# Altium schematic sheet Filters.SchDoc
size A2; SheetNumber: 2; SheetTotal: 3
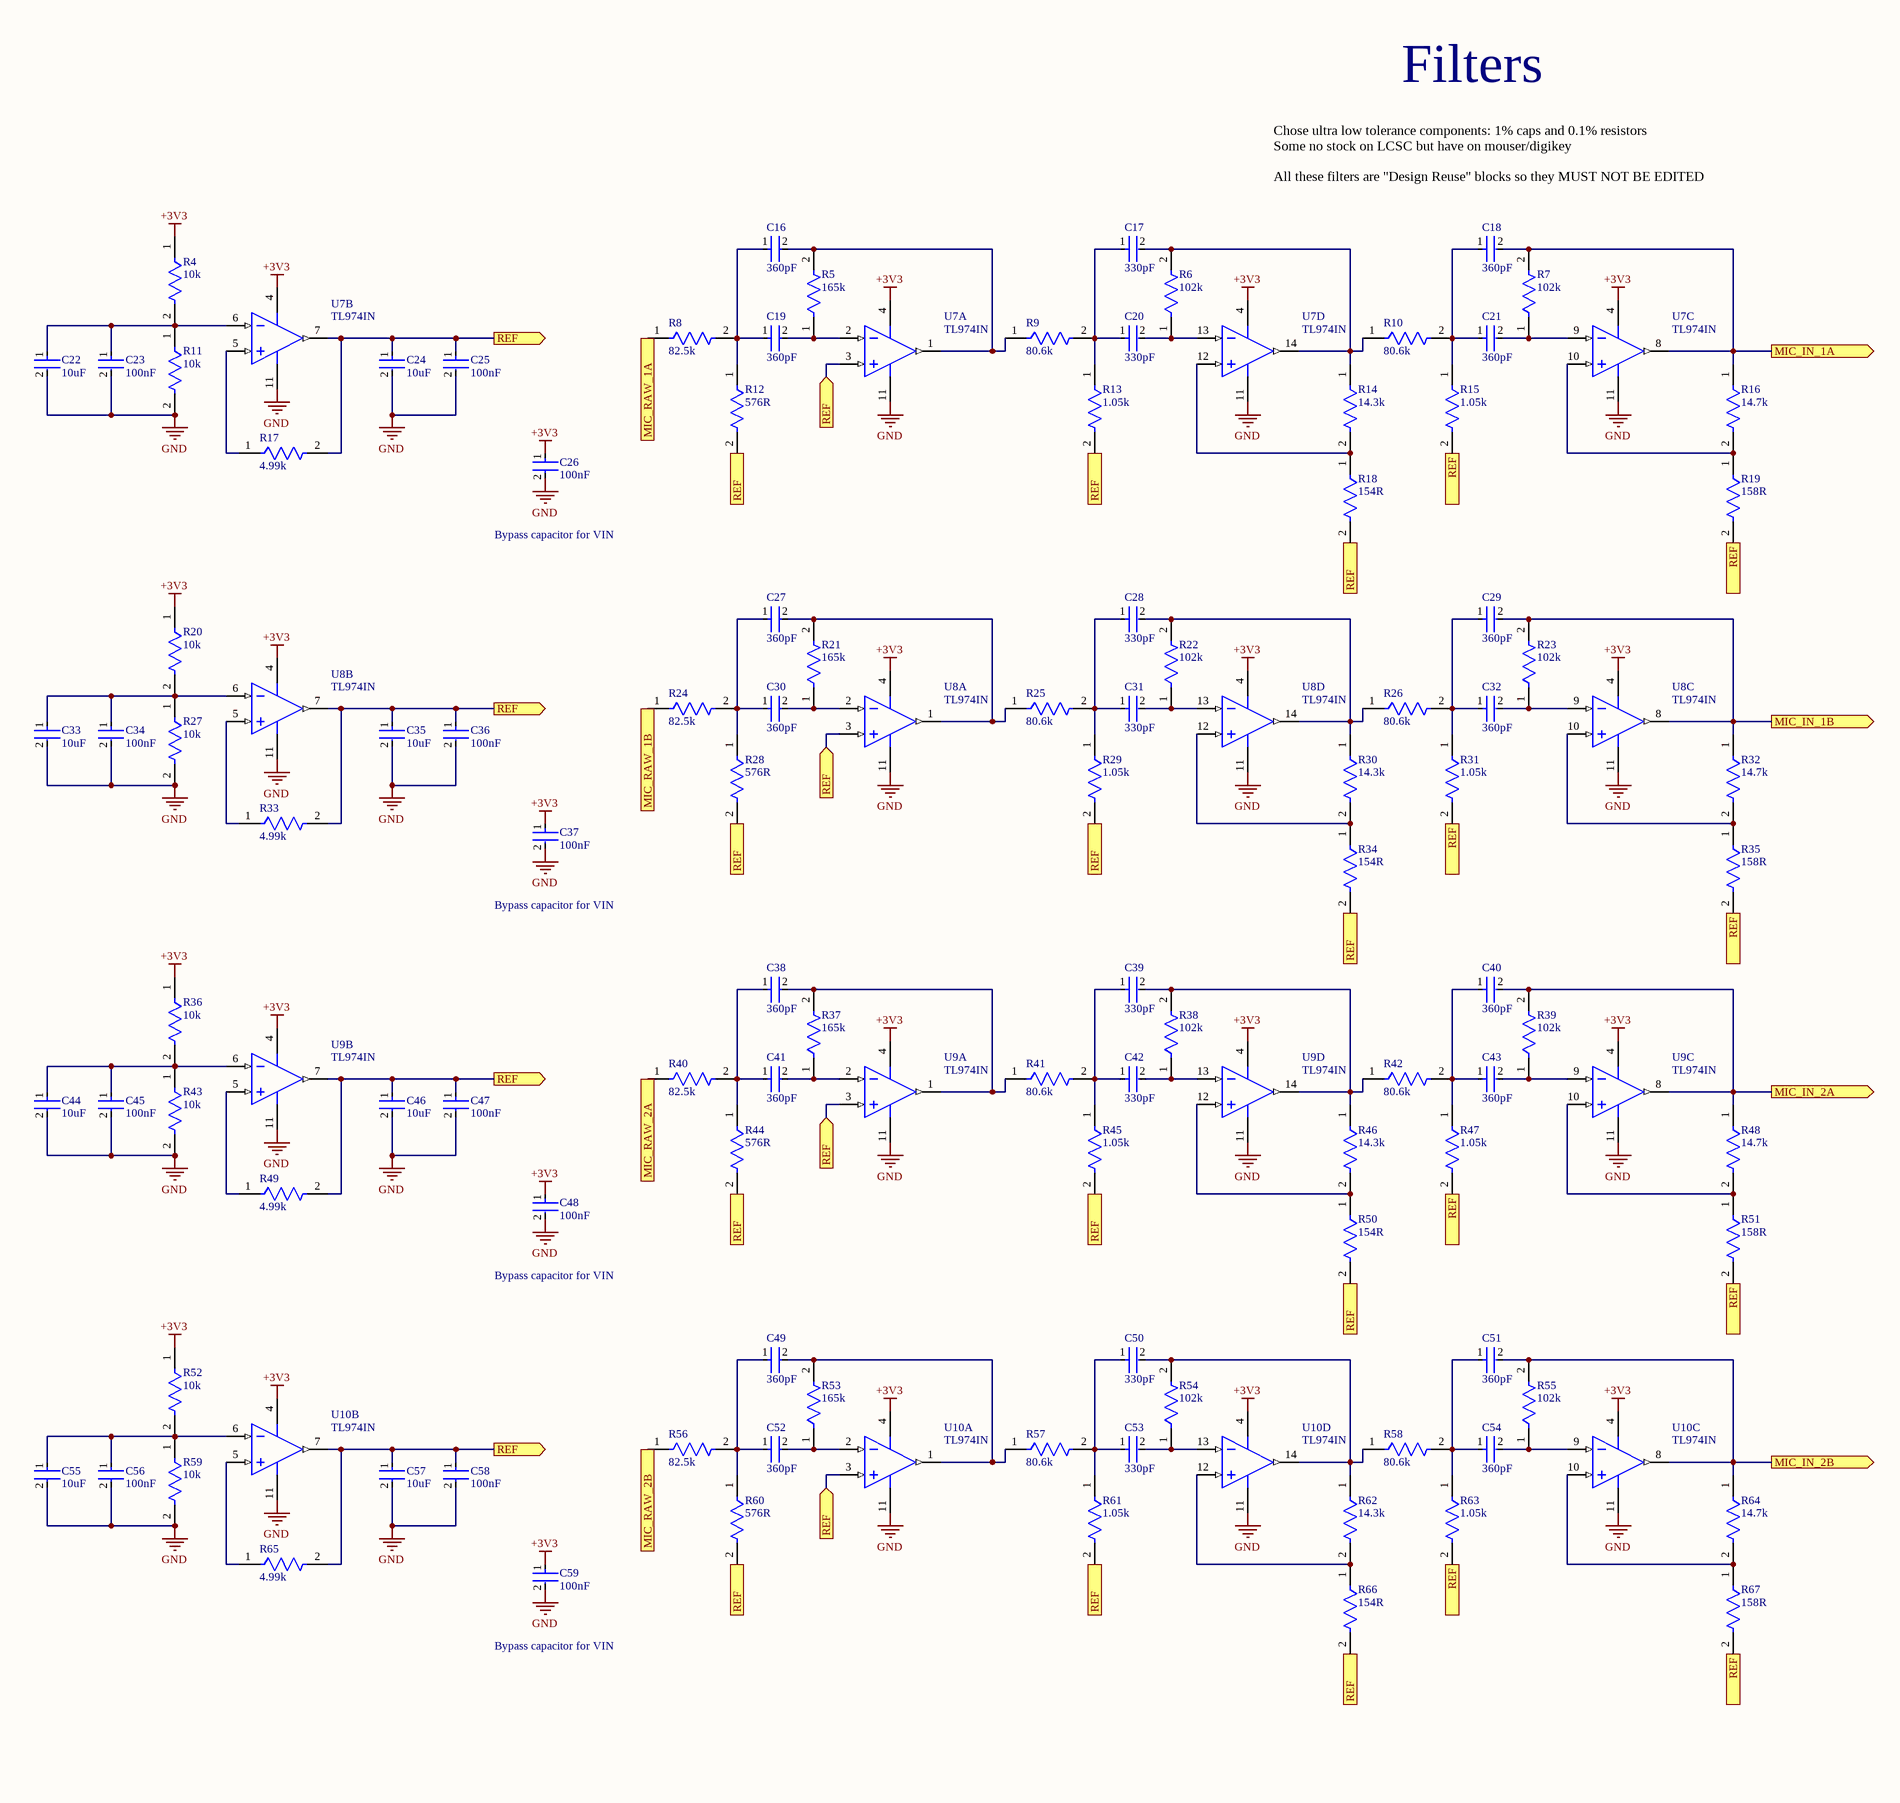
[diagram p0: Filters.SchDoc, left]
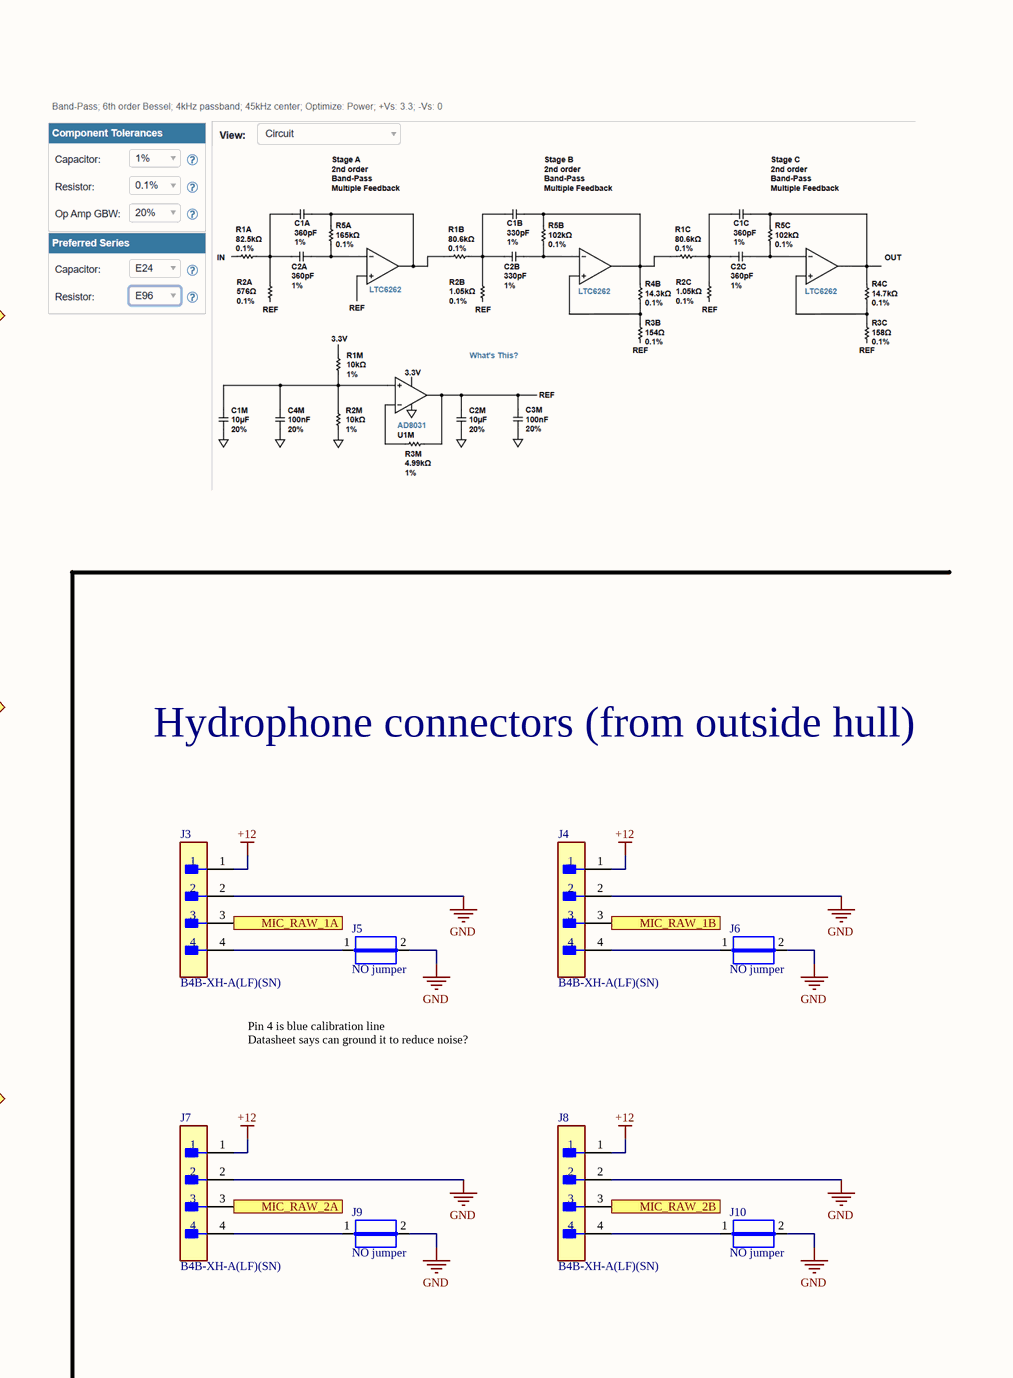
[diagram p1: Filters.SchDoc, right]

## Parts
C16  360pF  [FP-GCM188-0_1-IPC_A]
C17  330pF  [FP-GCM188-0_1-IPC_A]
C18  360pF  [FP-GCM188-0_1-IPC_A]
C19  360pF  [FP-GCM188-0_1-IPC_A]
C20  330pF  [FP-GCM188-0_1-IPC_A]
C21  360pF  [FP-GCM188-0_1-IPC_A]
C22  10uF  [FP-GCM188-0_1-IPC_A]
C23  100nF  [FP-GCM188-0_1-IPC_A]
C24  10uF  [FP-GCM188-0_1-IPC_A]
C25  100nF  [FP-GCM188-0_1-IPC_A]
C26  100nF  [FP-GCM188-0_1-IPC_A]
C27  360pF  [FP-GCM188-0_1-IPC_A]
C28  330pF  [FP-GCM188-0_1-IPC_A]
C29  360pF  [FP-GCM188-0_1-IPC_A]
C30  360pF  [FP-GCM188-0_1-IPC_A]
C31  330pF  [FP-GCM188-0_1-IPC_A]
C32  360pF  [FP-GCM188-0_1-IPC_A]
C33  10uF  [FP-GCM188-0_1-IPC_A]
C34  100nF  [FP-GCM188-0_1-IPC_A]
C35  10uF  [FP-GCM188-0_1-IPC_A]
C36  100nF  [FP-GCM188-0_1-IPC_A]
C37  100nF  [FP-GCM188-0_1-IPC_A]
C38  360pF  [FP-GCM188-0_1-IPC_A]
C39  330pF  [FP-GCM188-0_1-IPC_A]
C40  360pF  [FP-GCM188-0_1-IPC_A]
C41  360pF  [FP-GCM188-0_1-IPC_A]
C42  330pF  [FP-GCM188-0_1-IPC_A]
C43  360pF  [FP-GCM188-0_1-IPC_A]
C44  10uF  [FP-GCM188-0_1-IPC_A]
C45  100nF  [FP-GCM188-0_1-IPC_A]
C46  10uF  [FP-GCM188-0_1-IPC_A]
C47  100nF  [FP-GCM188-0_1-IPC_A]
C48  100nF  [FP-GCM188-0_1-IPC_A]
C49  360pF  [FP-GCM188-0_1-IPC_A]
C50  330pF  [FP-GCM188-0_1-IPC_A]
C51  360pF  [FP-GCM188-0_1-IPC_A]
C52  360pF  [FP-GCM188-0_1-IPC_A]
C53  330pF  [FP-GCM188-0_1-IPC_A]
C54  360pF  [FP-GCM188-0_1-IPC_A]
C55  10uF  [FP-GCM188-0_1-IPC_A]
C56  100nF  [FP-GCM188-0_1-IPC_A]
C57  10uF  [FP-GCM188-0_1-IPC_A]
C58  100nF  [FP-GCM188-0_1-IPC_A]
C59  100nF  [FP-GCM188-0_1-IPC_A]
J3  B4B-XH-A(LF)(SN)  [FP-B4B-XH-A_LF_SN-MFG]
J4  B4B-XH-A(LF)(SN)  [FP-B4B-XH-A_LF_SN-MFG]
J5  NO jumper  [JUMPER]
J6  NO jumper  [JUMPER]
J7  B4B-XH-A(LF)(SN)  [FP-B4B-XH-A_LF_SN-MFG]
J8  B4B-XH-A(LF)(SN)  [FP-B4B-XH-A_LF_SN-MFG]
J9  NO jumper  [JUMPER]
J10  NO jumper  [JUMPER]
R4  10k  [FP-RT0603-IPC_A]
R5  165k  [FP-RT0603-IPC_A]
R6  102k  [FP-RT0603-IPC_A]
R7  102k  [FP-RT0603-IPC_A]
R8  82.5k  [FP-RT0603-IPC_A]
R9  80.6k  [FP-RT0603-IPC_A]
R10  80.6k  [FP-RT0603-IPC_A]
R11  10k  [FP-RT0603-IPC_A]
R12  576R  [FP-RT0603-IPC_A]
R13  1.05k  [FP-RT0603-IPC_A]
R14  14.3k  [FP-RT0603-IPC_A]
R15  1.05k  [FP-RT0603-IPC_A]
R16  14.7k  [FP-RT0603-IPC_A]
R17  4.99k  [FP-RT0603-IPC_A]
R18  154R  [FP-RT0603-IPC_A]
R19  158R  [FP-RT0603-IPC_A]
R20  10k  [FP-RT0603-IPC_A]
R21  165k  [FP-RT0603-IPC_A]
R22  102k  [FP-RT0603-IPC_A]
R23  102k  [FP-RT0603-IPC_A]
R24  82.5k  [FP-RT0603-IPC_A]
R25  80.6k  [FP-RT0603-IPC_A]
R26  80.6k  [FP-RT0603-IPC_A]
R27  10k  [FP-RT0603-IPC_A]
R28  576R  [FP-RT0603-IPC_A]
R29  1.05k  [FP-RT0603-IPC_A]
R30  14.3k  [FP-RT0603-IPC_A]
R31  1.05k  [FP-RT0603-IPC_A]
R32  14.7k  [FP-RT0603-IPC_A]
R33  4.99k  [FP-RT0603-IPC_A]
R34  154R  [FP-RT0603-IPC_A]
R35  158R  [FP-RT0603-IPC_A]
R36  10k  [FP-RT0603-IPC_A]
R37  165k  [FP-RT0603-IPC_A]
R38  102k  [FP-RT0603-IPC_A]
R39  102k  [FP-RT0603-IPC_A]
R40  82.5k  [FP-RT0603-IPC_A]
R41  80.6k  [FP-RT0603-IPC_A]
R42  80.6k  [FP-RT0603-IPC_A]
R43  10k  [FP-RT0603-IPC_A]
R44  576R  [FP-RT0603-IPC_A]
R45  1.05k  [FP-RT0603-IPC_A]
R46  14.3k  [FP-RT0603-IPC_A]
R47  1.05k  [FP-RT0603-IPC_A]
R48  14.7k  [FP-RT0603-IPC_A]
R49  4.99k  [FP-RT0603-IPC_A]
R50  154R  [FP-RT0603-IPC_A]
R51  158R  [FP-RT0603-IPC_A]
R52  10k  [FP-RT0603-IPC_A]
R53  165k  [FP-RT0603-IPC_A]
R54  102k  [FP-RT0603-IPC_A]
R55  102k  [FP-RT0603-IPC_A]
R56  82.5k  [FP-RT0603-IPC_A]
R57  80.6k  [FP-RT0603-IPC_A]
R58  80.6k  [FP-RT0603-IPC_A]
R59  10k  [FP-RT0603-IPC_A]
R60  576R  [FP-RT0603-IPC_A]
R61  1.05k  [FP-RT0603-IPC_A]
R62  14.3k  [FP-RT0603-IPC_A]
R63  1.05k  [FP-RT0603-IPC_A]
R64  14.7k  [FP-RT0603-IPC_A]
R65  4.99k  [FP-RT0603-IPC_A]
R66  154R  [FP-RT0603-IPC_A]
R67  158R  [FP-RT0603-IPC_A]
U7  TL974IN  [N0014A]  (parts A,B,C,D of 4)
U8  TL974IN  [N0014A]  (parts A,B,C,D of 4)
U9  TL974IN  [N0014A]  (parts A,B,C,D of 4)
U10  TL974IN  [N0014A]  (parts A,B,C,D of 4)

## Ports
MIC_IN_1A (out, see Teensy_and_ICs[4B]), MIC_IN_1B (out, see Teensy_and_ICs[4B]), MIC_IN_2A (out, see Teensy_and_ICs[4B]), MIC_IN_2B (out, see Teensy_and_ICs[4B]), MIC_RAW_1A (in, see Filters[3C]), MIC_RAW_1A (out, see Filters[7C]), MIC_RAW_1B (in, see Filters[2C]), MIC_RAW_1B (out, see Filters[7C]), MIC_RAW_2A (in, see Filters[3B]), MIC_RAW_2A (out, see Filters[7B]), MIC_RAW_2B (in, see Filters[2B]), MIC_RAW_2B (out, see Filters[7A]), REF (in, see Filters[4A], Filters[4B], Filters[4C], Filters[5A], Filters[5B], Filters[5C], Filters[6A], Filters[6B], Filters[6C], Filters[6D], Filters[7A], Filters[7B], Filters[7C], Filters[7D]), REF (in, see Filters[4A], Filters[4B], Filters[4C], Filters[5A], Filters[5B], Filters[5C], Filters[6A], Filters[6B], Filters[6C], Filters[7A], Filters[7B], Filters[7C], Filters[7D]), REF (out, see Filters[4A], Filters[4B], Filters[4C], Filters[5A], Filters[5B], Filters[5C], Filters[6A], Filters[6B], Filters[6C], Filters[6D], Filters[7A], Filters[7B], Filters[7C]), REF (out, see Filters[4A], Filters[4B], Filters[4C], Filters[5A], Filters[5B], Filters[5C], Filters[6A], Filters[6B], Filters[6C], Filters[6D], Filters[7A], Filters[7B], Filters[7D]), REF (out, see Filters[4A], Filters[4B], Filters[4C], Filters[5A], Filters[5B], Filters[5C], Filters[6A], Filters[6B], Filters[6C], Filters[6D], Filters[7A], Filters[7C], Filters[7D]), REF (out, see Filters[4A], Filters[4B], Filters[4C], Filters[5A], Filters[5B], Filters[5C], Filters[6A], Filters[6B], Filters[6C], Filters[6D], Filters[7B], Filters[7C], Filters[7D])

## Nets
+3V3: C26.1 C37.1 C48.1 C59.1 R4.1 R20.1 R36.1 R52.1 U7.4(VCC+) U8.4(VCC+) U9.4(VCC+) U10.4(VCC+)
+12: J3.1 J4.1 J7.1 J8.1
GND: C22.2 C23.2 C24.2 C25.2 C26.2 C33.2 C34.2 C35.2 C36.2 C37.2 C44.2 C45.2 C46.2 C47.2 C48.2 C55.2 C56.2 C57.2 C58.2 C59.2 J3.2 J4.2 J5.2 J6.2 J7.2 J8.2 J9.2 J10.2 R11.2 R27.2 R43.2 R59.2 U7.11(VCC-) U8.11(VCC-) U9.11(VCC-) U10.11(VCC-)
MIC_IN_1A: C18.2 R7.2 R16.1 U7.8(OUT3) ; port MIC_IN_1A
MIC_IN_1B: C29.2 R23.2 R32.1 U8.8(OUT3) ; port MIC_IN_1B
MIC_IN_2A: C40.2 R39.2 R48.1 U9.8(OUT3) ; port MIC_IN_2A
MIC_IN_2B: C51.2 R55.2 R64.1 U10.8(OUT3) ; port MIC_IN_2B
MIC_RAW_1A: J3.3 R8.1 ; port MIC_RAW_1A
MIC_RAW_1B: J4.3 R24.1 ; port MIC_RAW_1B
MIC_RAW_2A: J7.3 R40.1 ; port MIC_RAW_2A
MIC_RAW_2B: J8.3 R56.1 ; port MIC_RAW_2B
REF: C24.1 C25.1 C35.1 C36.1 C46.1 C47.1 C57.1 C58.1 R12.2 R13.2 R15.2 R17.2 R18.2 R19.2 R28.2 R29.2 R31.2 R33.2 R34.2 R35.2 R44.2 R45.2 R47.2 R49.2 R50.2 R51.2 R60.2 R61.2 R63.2 R65.2 R66.2 R67.2 U7.3(IN1+) U7.7(OUT2) U8.3(IN1+) U8.7(OUT2) U9.3(IN1+) U9.7(OUT2) U10.3(IN1+) U10.7(OUT2) ; port REF
NetC16_1: C16.1 C19.1 R8.2 R12.1
NetC16_2: C16.2 R5.2 R9.1 U7.1(OUT1)
NetC17_1: C17.1 C20.1 R9.2 R13.1
NetC17_2: C17.2 R6.2 R10.1 R14.1 U7.14(OUT4)
NetC18_1: C18.1 C21.1 R10.2 R15.1
NetC19_2: C19.2 R5.1 U7.2(IN1-)
NetC20_2: C20.2 R6.1 U7.13(IN4-)
NetC21_2: C21.2 R7.1 U7.9(IN3-)
NetC22_1: C22.1 C23.1 R4.2 R11.1 U7.6(IN2-)
NetC27_1: C27.1 C30.1 R24.2 R28.1
NetC27_2: C27.2 R21.2 R25.1 U8.1(OUT1)
NetC28_1: C28.1 C31.1 R25.2 R29.1
NetC28_2: C28.2 R22.2 R26.1 R30.1 U8.14(OUT4)
NetC29_1: C29.1 C32.1 R26.2 R31.1
NetC30_2: C30.2 R21.1 U8.2(IN1-)
NetC31_2: C31.2 R22.1 U8.13(IN4-)
NetC32_2: C32.2 R23.1 U8.9(IN3-)
NetC33_1: C33.1 C34.1 R20.2 R27.1 U8.6(IN2-)
NetC38_1: C38.1 C41.1 R40.2 R44.1
NetC38_2: C38.2 R37.2 R41.1 U9.1(OUT1)
NetC39_1: C39.1 C42.1 R41.2 R45.1
NetC39_2: C39.2 R38.2 R42.1 R46.1 U9.14(OUT4)
NetC40_1: C40.1 C43.1 R42.2 R47.1
NetC41_2: C41.2 R37.1 U9.2(IN1-)
NetC42_2: C42.2 R38.1 U9.13(IN4-)
NetC43_2: C43.2 R39.1 U9.9(IN3-)
NetC44_1: C44.1 C45.1 R36.2 R43.1 U9.6(IN2-)
NetC49_1: C49.1 C52.1 R56.2 R60.1
NetC49_2: C49.2 R53.2 R57.1 U10.1(OUT1)
NetC50_1: C50.1 C53.1 R57.2 R61.1
NetC50_2: C50.2 R54.2 R58.1 R62.1 U10.14(OUT4)
NetC51_1: C51.1 C54.1 R58.2 R63.1
NetC52_2: C52.2 R53.1 U10.2(IN1-)
NetC53_2: C53.2 R54.1 U10.13(IN4-)
NetC54_2: C54.2 R55.1 U10.9(IN3-)
NetC55_1: C55.1 C56.1 R52.2 R59.1 U10.6(IN2-)
NetJ3_4: J3.4 J5.1
NetJ4_4: J4.4 J6.1
NetJ7_4: J7.4 J9.1
NetJ8_4: J8.4 J10.1
NetR14_2: R14.2 R18.1 U7.12(IN4+)
NetR16_2: R16.2 R19.1 U7.10(IN3+)
NetR17_1: R17.1 U7.5(IN2+)
NetR30_2: R30.2 R34.1 U8.12(IN4+)
NetR32_2: R32.2 R35.1 U8.10(IN3+)
NetR33_1: R33.1 U8.5(IN2+)
NetR46_2: R46.2 R50.1 U9.12(IN4+)
NetR48_2: R48.2 R51.1 U9.10(IN3+)
NetR49_1: R49.1 U9.5(IN2+)
NetR62_2: R62.2 R66.1 U10.12(IN4+)
NetR64_2: R64.2 R67.1 U10.10(IN3+)
NetR65_1: R65.1 U10.5(IN2+)

## Notes on the sheet
- Filters
- Chose ultra low tolerance components: 1% caps and 0.1% resistors
  Some no stock on LCSC but have on mouser/digikey
  All these filters are "Design Reuse" blocks so they MUST NOT BE EDITED
- Bypass capacitor for VIN
- Hydrophone connectors (from outside hull)
- Pin 4 is blue calibration line
  Datasheet says can ground it to reduce noise?
- DWG. NO.
- REV.
- SHT.
- THIS DOCUMENT AND THE DATA DISCLOSED HEREIN OR HEREWITH IS THE PROPERTY OF ALTIUM LIMITED AND MAY BE FREELY DISTRIBUTED IN WHOLE. NO RIGHTS ARE RESERVED OR EXPRESS OR IMPLIED WARANTEE GIVEN.
- REVISION
- DESCRIPTION
- DATE
- APPROVED
- ENG:
- APPROVALS
- PROJECT
- DSN:
- CHK:
- REFERENCE DOCUMENTS
- PROJECT REVISION:
- TITLE
- DOCUMENT REVISION:
- DESIGN ITEM:
- BOM:
- FAB DWG:
- PCB DWG:
- ASSY DWG:
- SCALE:
- SIZE
- B
- CAGE CODE
- FILE NAME
- DWG NO.
- SHEET
- OF
- REV

## Library data of the parts
C16 C18 C19 C21 C27 C29 C30 C32 C38 C40 C41 C43 C49 C51 C52 C54 = CMP-00016-1: Ceramic Capacitor, Multilayer, Ceramic, 100V, 1% +Tol, 1% -Tol, C0G, 30ppm/Cel TC, 0.00036uF, Surface Mount, 0603; Reference Standard: AEC-Q200; Multilayer: Yes; Packaging: Tape and Reel; Case/Package: 0603; Pins: 2; Temperature Characteristics Code: C0G; Termination: Wraparound; Min Operating Temperature: -55°C; Max Operating Temperature: 125°C; Capacitor Type: Ceramic; Value: 360pF; Tolerance (fill in as +-): 1%; RoHS Compliant: Yes; Dielectric Material: Ceramic; Rated DC Voltage (URdc): 100V; Reach SVHC Compliant: Yes; Mounting Technology: Surface Mount; Tolerance  (fill in as +-): 1%; Package Shape: Rectangular
C17 C20 C28 C31 C39 C42 C50 C53 = CMP-00012-1: Ceramic Capacitor, Multilayer, Ceramic, 50V, 1% +Tol, 1% -Tol, C0G, -/+30ppm/Cel TC, 0.00033uF, Surface Mount, 0603; Manufacturer Series: GRM18; Multilayer: Yes; Capacitor Type: Ceramic; Package Shape: Rectangular; Case/Package: 0603; Terminal Finish: Tin; Tolerance (fill in as +-): 1%; Packaging: Tape and Reel; Mounting Technology: Surface Mount; Max Operating Temperature: 125°C; Dielectric Material: Ceramic; Termination: Wraparound; Value: 330pF; Tolerance  (fill in as +-): 1%; Reach SVHC Compliant: Yes; RoHS Compliant: Yes; Min Operating Temperature: -55°C; JESD-609 Code: e3; Rated DC Voltage (URdc): 50V; Temperature Characteristics Code: C0G; Pins: 2
C22 C24 C33 C35 C44 C46 C55 C57 = CMP-00036-2: 25V 10uF Ceramic Capacitor, Multilayer, Ceramic, 25V, 10% +Tol, 10% -Tol, X5R, 15% TC, 10uF, Surface Mount, 0603; Multilayer: Yes; Max Operating Temperature: 85°C; Termination: Wraparound; Tolerance  (fill in as +-): 10%; Case/Package: 0603; Terminal Finish: Nickel; Pins: 2; Packaging: Tape and Reel; Temperature Characteristics Code: X5R; Value: 10uF; JESD-609 Code: e3; Mounting Technology: Surface Mount; Reach SVHC Compliant: Yes; Min Operating Temperature: -55°C; RoHS Compliant: Yes; Package Shape: Rectangular; Tolerance (fill in as +-): 10%; Capacitor Type: Ceramic; Dielectric Material: Ceramic; Rated DC Voltage (URdc): 25V
C23 C25 C26 C34 C36 C37 C45 C47 C48 C56 C58 C59 = CMP-00033-2: 50V 100nF Ceramic Capacitor, Multilayer, Ceramic, 50V, 10% +Tol, 10% -Tol, X7R, 15% TC, 0.1uF, Surface Mount, 0603; Multilayer: Yes; Max Operating Temperature: 125°C; Tolerance (fill in as +-): 10%; Packaging: Tape and Reel; Min Operating Temperature: -55°C; Package Style: SMTMeter; Termination: Wraparound; Pins: 2; Dielectric Material: Ceramic; Temperature Characteristics Code: X7R; JESD-609 Code: e3; Width: 0.8mm; Rated DC Voltage (URdc): 50V; Package Shape: Rectangular; Case/Package: 0603; Length: 1.6mm; Height: 0.8mm; Reach SVHC Compliant: Yes; Value: 100nF; Capacitor Type: Ceramic; Tolerance  (fill in as +-): 10%; Terminal Finish: Nickel; Mounting Technology: Surface Mount; RoHS Compliant: Yes
J3 J4 J7 J8 = CMP-00038-1: Header for PCB; pitch 2.50mm; 4-contacts; THT male; top entry; 250V/3A
J5 J6 J9 J10 = CMP-009-00183-1: Normally-Open SMD jumper pads; Pins: 2
R4 R11 R20 R27 R36 R43 R52 R59 = CMP-00035-1: 10k 1% Fixed Resistor, Metal Glaze/thick Film, 0.1W, 10000ohm, 75V, 1% +/-Tol, 100ppm/Cel, Surface Mount, 0603; Power: 100mW; Temperature Coefficient (ppm/Cel): 100; Package Height: 0.45mm; Package Length: 1.6mm; Additional Feature: LASER TRIMMABLE; Package Width: 0.8mm; Value: 10kR; Rated Temperature: 70°C; Construction: Chip; Resistor Type: FIXED RESISTOR; Terminal Finish: Nickel; Mounting Technology: Surface Mount; Technology: METAL GLAZE/THICK FILM; Min Operating Temperature: -55°C; Pins: 2; Termination: Wraparound; Working Voltage: 75V; RoHS Compliant: Yes; Packaging: Tape and Reel; Case/Package: 0603; JESD-609 Code: e3; Package Shape: Rectangular; Reach SVHC Compliant: Yes; Max Operating Temperature: 155°C; Tolerance: 1%
R5 R21 R37 R53 = CMP-00023-1: 165k Fixed Resistor, Thin Film, 0.1W, 165000ohm, 75V, 0.1% +/-Tol, 25ppm/Cel, Surface Mount, 0603; Rated Temperature: 70°C; Power: 100mW; Package Width: 0.8mm; Package Height: 0.45mm; Temperature Coefficient (ppm/Cel): 25; Value: 165kR; Package Length: 1.6mm; Min Operating Temperature: -55°C; Working Voltage: 75V; Termination: Wraparound; Pins: 2; Tolerance: 0.1%; Construction: Chip; Reach SVHC Compliant: Yes; Case/Package: 0603; Technology: THIN FILM; Resistor Type: FIXED RESISTOR; Packaging: Tape and Reel; RoHS Compliant: Yes; Mounting Technology: Surface Mount; Max Operating Temperature: 155°C
R6 R7 R22 R23 R38 R39 R54 R55 = CMP-00011-2: 102k Fixed Resistor, Thin Film, 0.1W, 102000ohm, 75V, 0.1% +/-Tol, 25ppm/Cel, Surface Mount, 0603; Package Length: 1.6mm; Value: 102kR; Package Width: 0.8mm; Power: 100mW; Temperature Coefficient (ppm/Cel): 25; Package Height: 0.45mm; Rated Temperature: 70°C; Pins: 2; RoHS Compliant: Yes; Mounting Technology: Surface Mount; Packaging: Tape and Reel; Min Operating Temperature: -55°C; Max Operating Temperature: 155°C; Tolerance: 0.1%; Resistor Type: FIXED RESISTOR; Case/Package: 0603; Technology: THIN FILM; Construction: Chip; Working Voltage: 75V; Termination: Wraparound; Reach SVHC Compliant: Yes
R8 R24 R40 R56 = CMP-00022-2: 82.5k Fixed Resistor, Thin Film, 0.1W, 82500ohm, 75V, 0.1% +/-Tol, 25ppm/Cel, Surface Mount, 0603; Package Width: 0.8mm; Rated Temperature: 70°C; Value: 82.5kR; Temperature Coefficient (ppm/Cel): 25; Package Height: 0.45mm; Power: 100mW; Package Length: 1.6mm; Pins: 2; Working Voltage: 75V; Packaging: Tape and Reel; Construction: Chip; Reach SVHC Compliant: Yes; Tolerance: 0.1%; Termination: Wraparound; Technology: THIN FILM; Case/Package: 0603; Max Operating Temperature: 155°C; Min Operating Temperature: -55°C; Mounting Technology: Surface Mount; Resistor Type: FIXED RESISTOR; RoHS Compliant: Yes
R9 R10 R25 R26 R41 R42 R57 R58 = CMP-00025-2: 80.6k Fixed Resistor, Thin Film, 0.1W, 80600ohm, 75V, 0.1% +/-Tol, 25ppm/Cel, Surface Mount, 0603; Package Width: 0.8mm; Package Height: 0.45mm; Power: 100mW; Value: 80.6kR; Temperature Coefficient (ppm/Cel): 25; Package Length: 1.6mm; Rated Temperature: 70°C; Working Voltage: 75V; Mounting Technology: Surface Mount; Technology: THIN FILM; Construction: Chip; Tolerance: 0.1%; Reach SVHC Compliant: Yes; Resistor Type: FIXED RESISTOR; Pins: 2; Packaging: Tape and Reel; Max Operating Temperature: 155°C; Termination: Wraparound; RoHS Compliant: Yes; Min Operating Temperature: -55°C; Case/Package: 0603
R12 R28 R44 R60 = CMP-00024-2: 576R Fixed Resistor, Thin Film, 0.1W, 576ohm, 75V, 0.1% +/-Tol, 25ppm/Cel, Surface Mount, 0603; Power: 100mW; Package Height: 0.45mm; Package Length: 1.6mm; Temperature Coefficient (ppm/Cel): 25; Rated Temperature: 70°C; Package Width: 0.8mm; RoHS Compliant: Yes; Mounting Technology: Surface Mount; Technology: THIN FILM; Value: 576R; Resistor Type: FIXED RESISTOR; Max Operating Temperature: 155°C; Termination: Wraparound; Pins: 2; Tolerance: 0.1%; Packaging: Tape and Reel; Reach SVHC Compliant: Yes; Min Operating Temperature: -55°C; Case/Package: 0603; Construction: Chip; Working Voltage: 75V
R13 R15 R29 R31 R45 R47 R61 R63 = CMP-00026-2: 1.05k Fixed Resistor, Thin Film, 0.1W, 1050ohm, 75V, 0.1% +/-Tol, 25ppm/Cel, Surface Mount, 0603; Package Width: 0.8mm; Rated Temperature: 70°C; Package Height: 0.45mm; Package Length: 1.6mm; Value: 1.05kR; Temperature Coefficient (ppm/Cel): 25; Power: 100mW; Mounting Technology: Surface Mount; Pins: 2; Max Operating Temperature: 155°C; Packaging: Tape and Reel; Tolerance: 0.1%; Reach SVHC Compliant: Yes; Construction: Chip; Working Voltage: 75V; Min Operating Temperature: -55°C; Termination: Wraparound; RoHS Compliant: Yes; Resistor Type: FIXED RESISTOR; Technology: THIN FILM; Case/Package: 0603
R14 R30 R46 R62 = CMP-00029-1: 14.3k Fixed Resistor, Thin Film, 0.1W, 14300ohm, 75V, 0.1% +/-Tol, 25ppm/Cel, Surface Mount, 0603; Temperature Coefficient (ppm/Cel): 25; Value: 14.3kR; Package Width: 0.8mm; Rated Temperature: 70°C; Power: 100mW; Package Length: 1.6mm; Package Height: 0.45mm; Construction: Chip; Max Operating Temperature: 155°C; RoHS Compliant: Yes; Technology: THIN FILM; Mounting Technology: Surface Mount; Min Operating Temperature: -55°C; Working Voltage: 75V; Case/Package: 0603; Pins: 2; Resistor Type: FIXED RESISTOR; Tolerance: 0.1%; Packaging: Tape and Reel; Termination: Wraparound; Reach SVHC Compliant: Yes
R16 R32 R48 R64 = CMP-00027-2: 14.7k Fixed Resistor, Thin Film, 0.1W, 14700ohm, 75V, 0.1% +/-Tol, 25ppm/Cel, Surface Mount, 0603; Rated Temperature: 70°C; Temperature Coefficient (ppm/Cel): 25; Package Height: 0.45mm; Package Width: 0.8mm; Value: 14.7kR; Package Length: 1.6mm; Power: 100mW; Termination: Wraparound; Tolerance: 0.1%; Pins: 2; Mounting Technology: Surface Mount; Case/Package: 0603; Min Operating Temperature: -55°C; Resistor Type: FIXED RESISTOR; Construction: Chip; Packaging: Tape and Reel; Technology: THIN FILM; Working Voltage: 75V; Reach SVHC Compliant: Yes; Max Operating Temperature: 155°C; RoHS Compliant: Yes
R17 R33 R49 R65 = CMP-00037-1: 4.99k 1% Fixed Resistor, Metal Glaze/thick Film, 0.1W, 4990ohm, 75V, 1% +/-Tol, 100ppm/Cel, Surface Mount, 0603; Value: 4.99kR; Package Length: 1.6mm; Additional Feature: LASER TRIMMABLE; Temperature Coefficient (ppm/Cel): 100; Package Width: 0.8mm; Package Height: 0.45mm; Rated Temperature: 70°C; Power: 100mW; Construction: Chip; Resistor Type: FIXED RESISTOR; Working Voltage: 75V; Case/Package: 0603; Min Operating Temperature: -55°C; Tolerance: 1%; Package Shape: Rectangular; Mounting Technology: Surface Mount; RoHS Compliant: Yes; Max Operating Temperature: 155°C; Pins: 2; Terminal Finish: Nickel; Termination: Wraparound; Reach SVHC Compliant: Yes; Technology: METAL GLAZE/THICK FILM; Packaging: Tape and Reel; JESD-609 Code: e3
R18 R34 R50 R66 = CMP-00030-1: 154R Fixed Resistor, Thin Film, 0.1W, 154ohm, 75V, 0.1% +/-Tol, 25ppm/Cel, Surface Mount, 0603; Rated Temperature: 70°C; Package Width: 0.8mm; Power: 100mW; Package Height: 0.45mm; Temperature Coefficient (ppm/Cel): 25; Package Length: 1.6mm; Construction: Chip; Reach SVHC Compliant: Yes; Packaging: Tape and Reel; Termination: Wraparound; Pins: 2; RoHS Compliant: Yes; Value: 154R; Min Operating Temperature: -55°C; Case/Package: 0603; Mounting Technology: Surface Mount; Technology: THIN FILM; Working Voltage: 75V; Tolerance: 0.1%; Max Operating Temperature: 155°C; Resistor Type: FIXED RESISTOR
R19 R35 R51 R67 = CMP-00028-2: 158R Fixed Resistor, Thin Film, 0.1W, 158ohm, 75V, 0.1% +/-Tol, 25ppm/Cel, Surface Mount, 0603; Package Length: 1.6mm; Rated Temperature: 70°C; Power: 100mW; Temperature Coefficient (ppm/Cel): 25; Package Height: 0.45mm; Package Width: 0.8mm; Resistor Type: FIXED RESISTOR; Value: 158R; Working Voltage: 75V; Termination: Wraparound; Min Operating Temperature: -55°C; Packaging: Tape and Reel; Construction: Chip; Technology: THIN FILM; Max Operating Temperature: 155°C; RoHS Compliant: Yes; Case/Package: 0603; Mounting Technology: Surface Mount; Tolerance: 0.1%; Pins: 2; Reach SVHC Compliant: Yes
U7-U10 = CMP-00019-1: Operational Amplifier, 4 Func, 6000uV Offset-Max, BIPolar, PDIP14; Surface Mount: No; Low-Offset: No; Slew Rate-Min: 3.5V/µs; Nominal Supply Voltage: 2.5V; Slew Rate: 5V/µs; Voltage Gain-Min: 3160; Power Supplies: +-2.5V; Average Bias Current-Max (IIB): 1uA; Common-mode Reject Ratio-Nom: 85dB; Input Offset Voltage-Max: 6mV; Unity Gain BW-Nom: 12MHz; Max Supply Current: 12.8mA; Package Equivalence Code: DIP8,.3; Qualification Status: Not Qualified; Supply Voltage Limit-Max: 15V; Bias Current-Max (IIB) @25C: 750nA; Architecture: VOLTAGE-FEEDBACK; Package Body Material: Plastic; Channels: 4; Frequency Compensation: YES; Neg Supply Voltage-Nom (Vsup): -2.5V; Height - Seated (Max): 5.08mm; Max Operating Temperature: 125°C; Temperature Grade: AUTOMOTIVE; Terminal Finish: Nickel; Packaging: Rail/Tube; Width: 7.62mm; Pins: 14; Technology: BIPOLAR; JESD-30 Code: R-PDIP-T14; Terminal Pitch: 2.54mm; Package Shape: Rectangular; Reach SVHC Compliant: Yes; JESD-609 Code: e4; Terminal Position: DUAL; Package Style: IN-LINEMeter; Min Operating Temperature: -40°C; Terminal Form: Through Hole; RoHS Compliant: Yes; Amplifier Type: OPERATIONAL AMPLIFIER; Case/Package: DIP; Length: 19.305mm